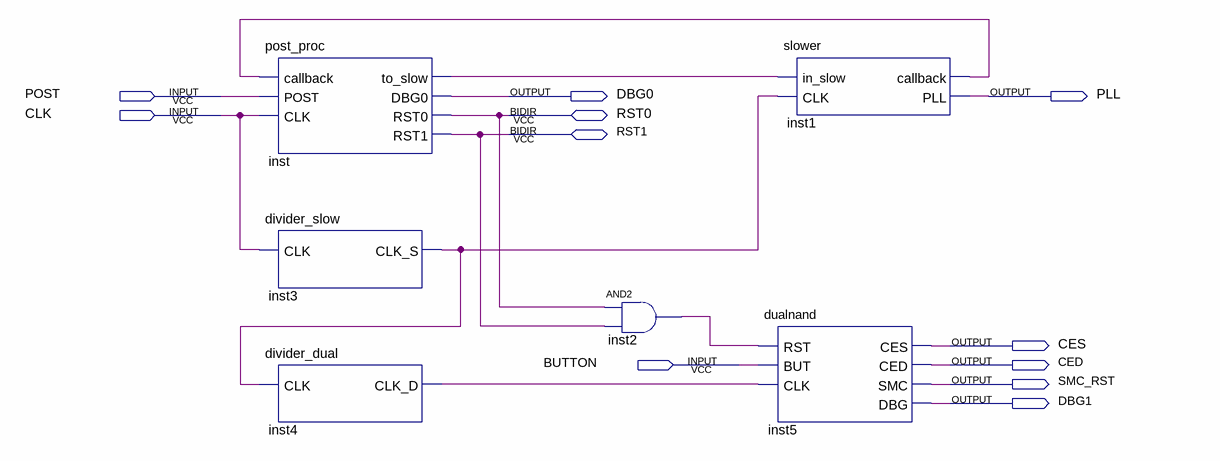
[diagram p0: schematic sheet]
// Quartus schematic main.bdf as structural Verilog: 6 symbols, 11 pins
module main (
  input  POST,
  input  CLK,
  input  BUTTON,
  inout  RST0,
  inout  RST1,
  output DBG0,
  output PLL,
  output CES,
  output CED,
  output SMC_RST,
  output DBG1
);

  wire inst1_callback, inst2_out, inst3_clk_s, inst4_clk_d, inst_to_slow;

  post_proc inst (
    .callback(inst1_callback), .POST(POST), .CLK(CLK), .to_slow(inst_to_slow), .DBG0(DBG0), .RST0(RST0),
    .RST1(RST1));
  divider_slow inst3 (.CLK(CLK), .CLK_S(inst3_clk_s));
  divider_dual inst4 (.CLK(inst3_clk_s), .CLK_D(inst4_clk_d));
  and inst2 (inst2_out, RST0, RST1);
  slower inst1 (.in_slow(inst_to_slow), .CLK(inst3_clk_s), .callback(inst1_callback), .PLL(PLL));
  dualnand inst5 (.RST(inst2_out), .BUT(BUTTON), .CLK(inst4_clk_d), .CES(CES), .CED(CED), .SMC(SMC_RST), .DBG(DBG1));
endmodule
